# Altium schematic sheet sla2216.SchDoc
size A4 portrait; DocumentNumber: 1; SheetNumber: 1; SheetTotal: 6
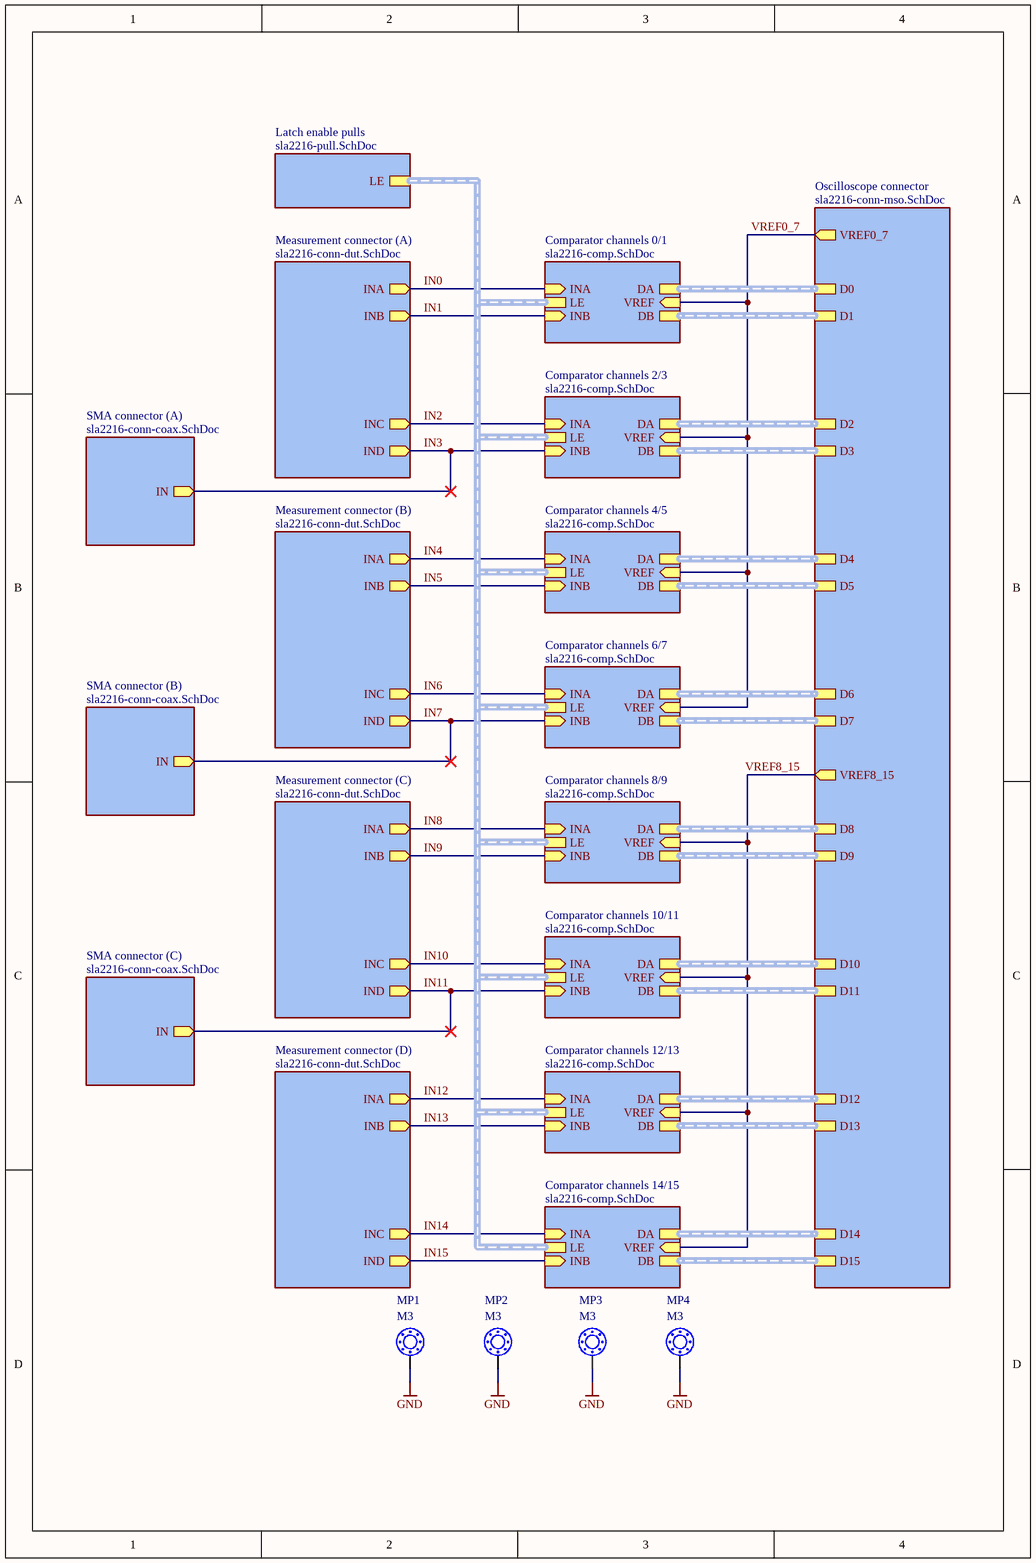
[diagram p0: sla2216.SchDoc]

## Parts
MP1  M3  [MP M3]  (no BOM)
MP2  M3  [MP M3]  (no BOM)
MP3  M3  [MP M3]  (no BOM)
MP4  M3  [MP M3]  (no BOM)

## Sub-sheets
Comparator channels 0/1 = sla2216-comp.SchDoc: DB (harness RSPECL), DA (harness RSPECL), INA (in), INB (in), VREF (in), LE (harness RSPECL)
Comparator channels 2/3 = sla2216-comp.SchDoc: DB (harness RSPECL), DA (harness RSPECL), INA (in), INB (in), VREF (in), LE (harness RSPECL)
Comparator channels 4/5 = sla2216-comp.SchDoc: DB (harness RSPECL), DA (harness RSPECL), INA (in), INB (in), VREF (in), LE (harness RSPECL)
Comparator channels 6/7 = sla2216-comp.SchDoc: DB (harness RSPECL), DA (harness RSPECL), INA (in), INB (in), VREF (in), LE (harness RSPECL)
Comparator channels 8/9 = sla2216-comp.SchDoc: DB (harness RSPECL), DA (harness RSPECL), INA (in), INB (in), VREF (in), LE (harness RSPECL)
Comparator channels 10/11 = sla2216-comp.SchDoc: DB (harness RSPECL), DA (harness RSPECL), INA (in), INB (in), VREF (in), LE (harness RSPECL)
Comparator channels 12/13 = sla2216-comp.SchDoc: DB (harness RSPECL), DA (harness RSPECL), INA (in), INB (in), VREF (in), LE (harness RSPECL)
Comparator channels 14/15 = sla2216-comp.SchDoc: DB (harness RSPECL), DA (harness RSPECL), INA (in), INB (in), VREF (in), LE (harness RSPECL)
Latch enable pulls = sla2216-pull.SchDoc: LE (harness RSPECL)
Measurement connector (A) = sla2216-conn-dut.SchDoc: INA (out), INB (out), INC (out), IND (out)
Measurement connector (B) = sla2216-conn-dut.SchDoc: INA (out), INB (out), INC (out), IND (out)
Measurement connector (C) = sla2216-conn-dut.SchDoc: INA (out), INB (out), INC (out), IND (out)
Measurement connector (D) = sla2216-conn-dut.SchDoc: INA (out), INB (out), INC (out), IND (out)
Oscilloscope connector = sla2216-conn-mso.SchDoc: D0 (harness RSPECL), D1 (harness RSPECL), D2 (harness RSPECL), D3 (harness RSPECL), VREF0_7 (out), D5 (harness RSPECL), D4 (harness RSPECL), D7 (harness RSPECL), D6 (harness RSPECL), VREF8_15 (out), D8 (harness RSPECL), D9 (harness RSPECL), D11 (harness RSPECL), D10 (harness RSPECL), D12 (harness RSPECL), D13 (harness RSPECL), D14 (harness RSPECL), D15 (harness RSPECL)
SMA connector (A) = sla2216-conn-coax.SchDoc: IN (out)
SMA connector (B) = sla2216-conn-coax.SchDoc: IN (out)
SMA connector (C) = sla2216-conn-coax.SchDoc: IN (out)

## Nets
GND: MP1.MP MP2.MP MP3.MP MP4.MP
IN0: sheet Comparator channels 0/1/INA, sheet Measurement connector (A)/INA
IN1: sheet Comparator channels 0/1/INB, sheet Measurement connector (A)/INB
IN2: sheet Comparator channels 2/3/INA, sheet Measurement connector (A)/INC
IN3: sheet Comparator channels 2/3/INB, sheet Measurement connector (A)/IND, sheet SMA connector (A)/IN
IN4: sheet Comparator channels 4/5/INA, sheet Measurement connector (B)/INA
IN5: sheet Comparator channels 4/5/INB, sheet Measurement connector (B)/INB
IN6: sheet Comparator channels 6/7/INA, sheet Measurement connector (B)/INC
IN7: sheet Comparator channels 6/7/INB, sheet Measurement connector (B)/IND, sheet SMA connector (B)/IN
IN8: sheet Comparator channels 8/9/INA, sheet Measurement connector (C)/INA
IN9: sheet Comparator channels 8/9/INB, sheet Measurement connector (C)/INB
IN10: sheet Comparator channels 10/11/INA, sheet Measurement connector (C)/INC
IN11: sheet Comparator channels 10/11/INB, sheet Measurement connector (C)/IND, sheet SMA connector (C)/IN
IN12: sheet Comparator channels 12/13/INA, sheet Measurement connector (D)/INA
IN13: sheet Comparator channels 12/13/INB, sheet Measurement connector (D)/INB
IN14: sheet Comparator channels 14/15/INA, sheet Measurement connector (D)/INC
IN15: sheet Comparator channels 14/15/INB, sheet Measurement connector (D)/IND
VREF0_7: sheet Oscilloscope connector/VREF0_7, sheet Comparator channels 0/1/VREF, sheet Comparator channels 2/3/VREF, sheet Comparator channels 4/5/VREF, sheet Comparator channels 6/7/VREF
VREF8_15: sheet Oscilloscope connector/VREF8_15, sheet Comparator channels 8/9/VREF, sheet Comparator channels 10/11/VREF, sheet Comparator channels 12/13/VREF, sheet Comparator channels 14/15/VREF

## Buses and harness runs
harness sheet Comparator channels 0/1/DA = sheet Oscilloscope connector/D0
harness sheet Comparator channels 0/1/DB = sheet Oscilloscope connector/D1
harness sheet Comparator channels 0/1/LE = sheet Comparator channels 2/3/LE = sheet Comparator channels 4/5/LE = sheet Comparator channels 6/7/LE = sheet Comparator channels 8/9/LE = sheet Comparator channels 10/11/LE = sheet Comparator channels 12/13/LE = sheet Comparator channels 14/15/LE = sheet Latch enable pulls/LE
harness sheet Comparator channels 2/3/DA = sheet Oscilloscope connector/D2
harness sheet Comparator channels 2/3/DB = sheet Oscilloscope connector/D3
harness sheet Comparator channels 4/5/DA = sheet Oscilloscope connector/D4
harness sheet Comparator channels 4/5/DB = sheet Oscilloscope connector/D5
harness sheet Comparator channels 6/7/DA = sheet Oscilloscope connector/D6
harness sheet Comparator channels 6/7/DB = sheet Oscilloscope connector/D7
harness sheet Comparator channels 8/9/DA = sheet Oscilloscope connector/D8
harness sheet Comparator channels 8/9/DB = sheet Oscilloscope connector/D9
harness sheet Comparator channels 10/11/DA = sheet Oscilloscope connector/D10
harness sheet Comparator channels 10/11/DB = sheet Oscilloscope connector/D11
harness sheet Comparator channels 12/13/DA = sheet Oscilloscope connector/D12
harness sheet Comparator channels 12/13/DB = sheet Oscilloscope connector/D13
harness sheet Comparator channels 14/15/DA = sheet Oscilloscope connector/D14
harness sheet Comparator channels 14/15/DB = sheet Oscilloscope connector/D15

## Library data of the parts
MP1-MP4 = Mountpoint: PCB mountpoint